# Altium schematic sheet micro8051.SchDoc
size B
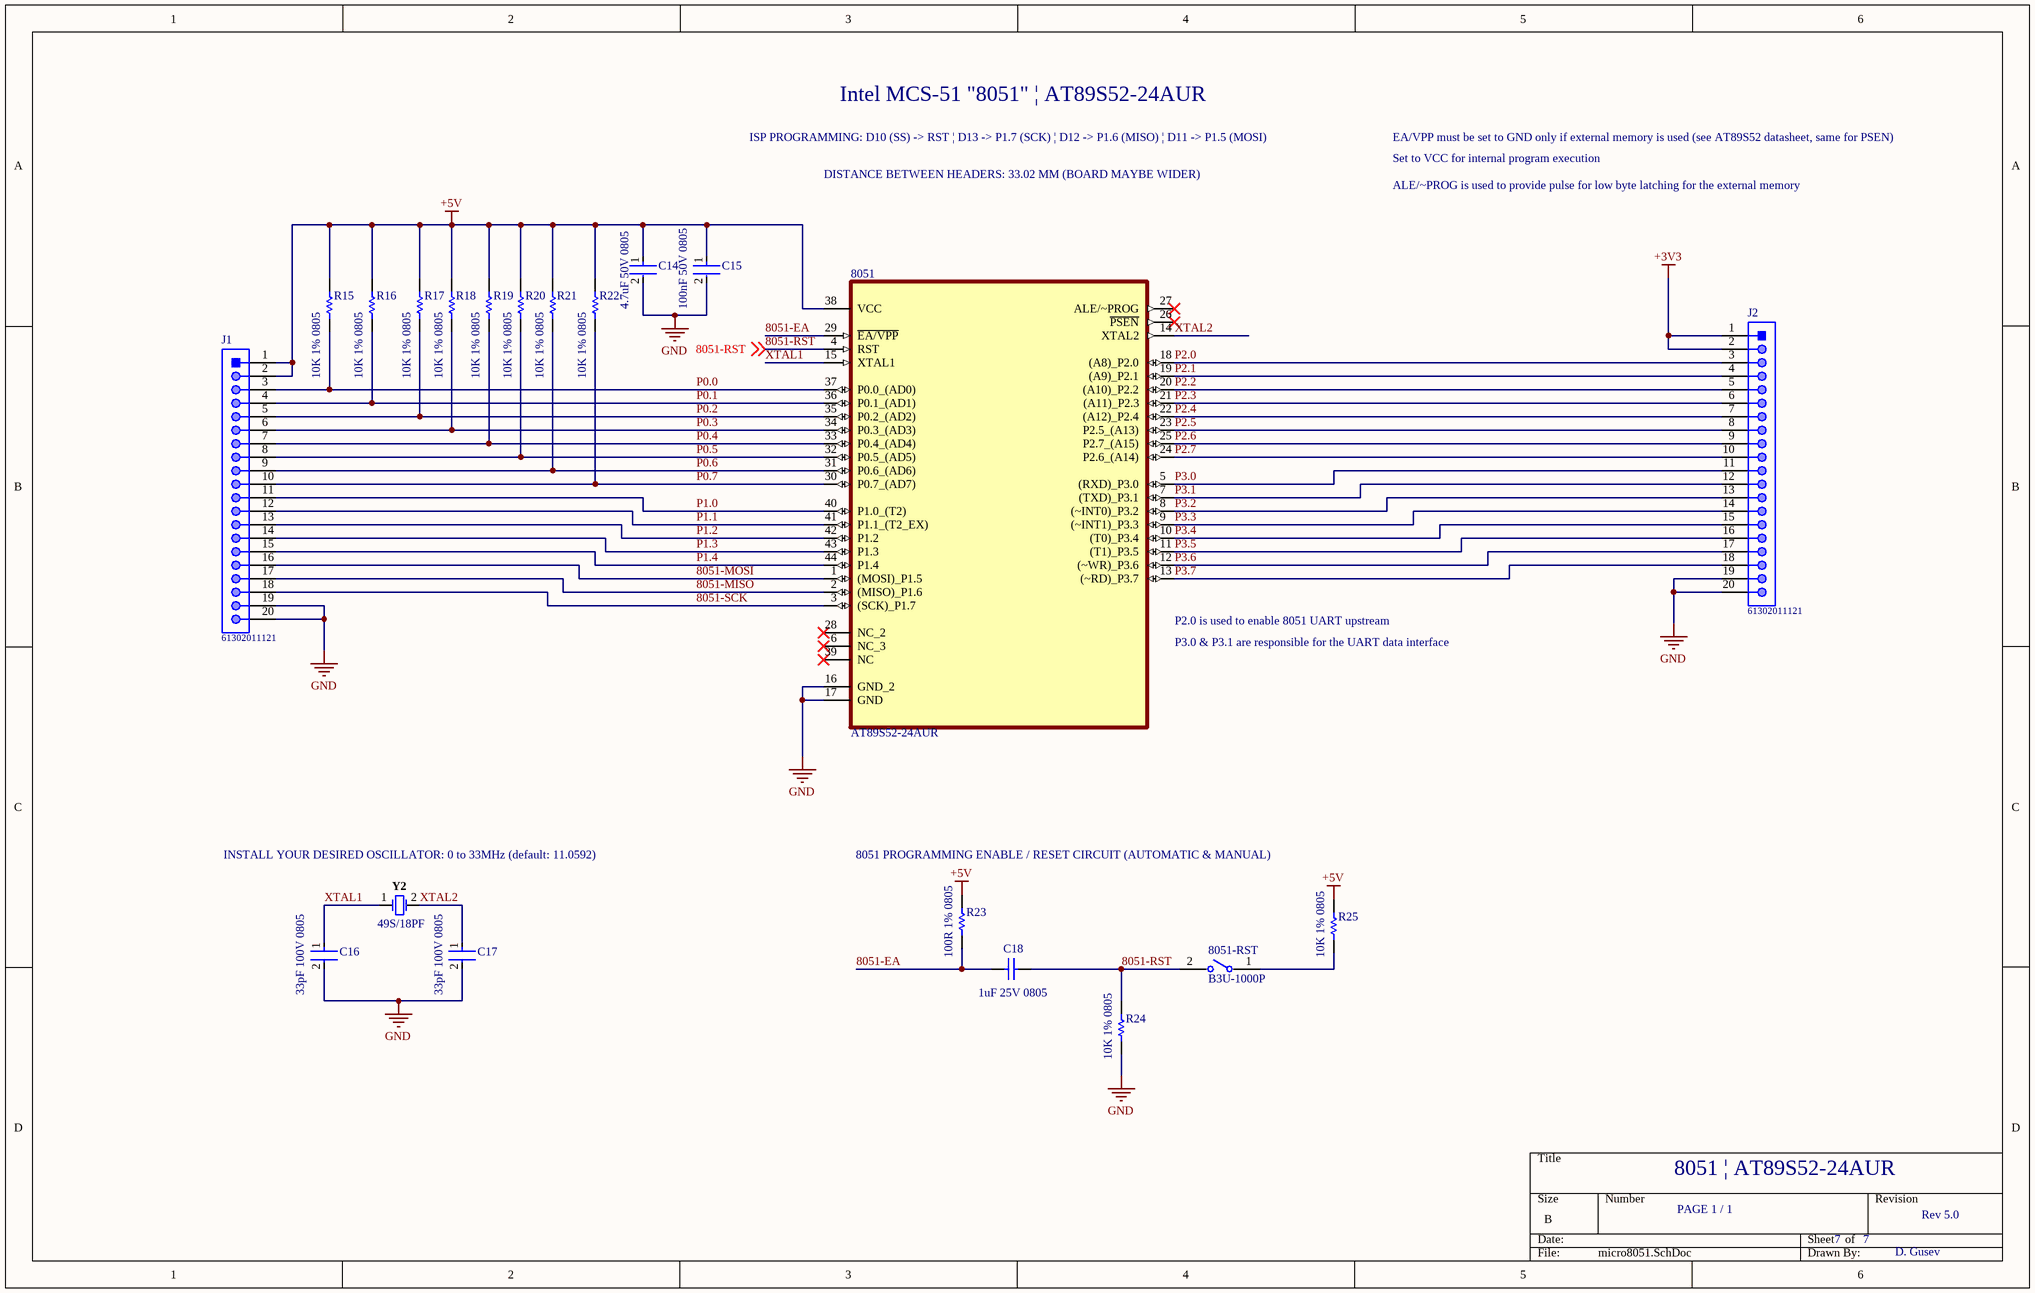
[diagram p0: micro8051.SchDoc]

## Parts
8051  AT89S52-24AUR  [AT89S52-24AUR]
8051-RST  B3U-1000P  [FP-B3U-1000P-MFG]
C14  4.7uF 50V 0805  [FP-C2012-125-MFG]
C15  100nF 50V 0805  [FP-C0805C-DN-MFG]
C16  33pF 100V 0805  [FP-C0805C-DN-MFG]
C17  33pF 100V 0805  [FP-C0805C-DN-MFG]
C18  1uF 25V 0805  [CAPC2013X140X50LL20T25]
J1  61302011121  [61302011121]
J2  61302011121  [61302011121]
R15  10K 1% 0805  [RESC2013X60X35NL10T20]
R16  10K 1% 0805  [RESC2013X60X35NL10T20]
R17  10K 1% 0805  [RESC2013X60X35NL10T20]
R18  10K 1% 0805  [RESC2013X60X35NL10T20]
R19  10K 1% 0805  [RESC2013X60X35NL10T20]
R20  10K 1% 0805  [RESC2013X60X35NL10T20]
R21  10K 1% 0805  [RESC2013X60X35NL10T20]
R22  10K 1% 0805  [RESC2013X60X35NL10T20]
R23  100R 1% 0805  [RESC2013X60X35ML10T20]
R24  10K 1% 0805  [RESC2013X60X35NL10T20]
R25  10K 1% 0805  [RESC2013X60X35NL10T20]
Y2  49S/18PF  [JPY-49S-18PF]

## Nets
+3V3: J2.1 J2.2
+5V: 8051.38(VCC) C14.1 C15.1 J1.1 J1.2 R15.2 R16.2 R17.2 R18.2 R19.2 R20.2 R21.2 R22.2 R23.2 R25.2
GND: 8051.16(GND_2) 8051.17(GND) C14.2 C15.2 C16.2 C17.2 J1.19 J1.20 J2.19 J2.20 R24.1
8051-EA: 8051.29(~{EA/VPP}) C18.1 R23.1
8051-MISO: 8051.2((MISO)_P1.6) J1.17
8051-MOSI: 8051.1((MOSI)_P1.5) J1.16
8051-RST: 8051.4(RST) 8051-RST.2 C18.2 R24.2 ; off-sheet 8051-RST
8051-SCK: 8051.3((SCK)_P1.7) J1.18
P0.0: 8051.37(P0.0_(AD0)) J1.3 R15.1
P0.1: 8051.36(P0.1_(AD1)) J1.4 R16.1
P0.2: 8051.35(P0.2_(AD2)) J1.5 R17.1
P0.3: 8051.34(P0.3_(AD3)) J1.6 R18.1
P0.4: 8051.33(P0.4_(AD4)) J1.7 R19.1
P0.5: 8051.32(P0.5_(AD5)) J1.8 R20.1
P0.6: 8051.31(P0.6_(AD6)) J1.9 R21.1
P0.7: 8051.30(P0.7_(AD7)) J1.10 R22.1
P1.0: 8051.40(P1.0_(T2)) J1.11
P1.1: 8051.41(P1.1_(T2_EX)) J1.12
P1.2: 8051.42(P1.2) J1.13
P1.3: 8051.43(P1.3) J1.14
P1.4: 8051.44(P1.4) J1.15
P2.0: 8051.18((A8)_P2.0) J2.3
P2.1: 8051.19((A9)_P2.1) J2.4
P2.2: 8051.20((A10)_P2.2) J2.5
P2.3: 8051.21((A11)_P2.3) J2.6
P2.4: 8051.22((A12)_P2.4) J2.7
P2.5: 8051.23(P2.5_(A13)) J2.8
P2.6: 8051.25(P2.7_(A15)) J2.9
P2.7: 8051.24(P2.6_(A14)) J2.10
P3.0: 8051.5((RXD)_P3.0) J2.11
P3.1: 8051.7((TXD)_P3.1) J2.12
P3.2: 8051.8((~INT0)_P3.2) J2.13
P3.3: 8051.9((~INT1)_P3.3) J2.14
P3.4: 8051.10((T0)_P3.4) J2.15
P3.5: 8051.11((T1)_P3.5) J2.16
P3.6: 8051.12((~WR)_P3.6) J2.17
P3.7: 8051.13((~RD)_P3.7) J2.18
XTAL1: 8051.15(XTAL1) C16.1 Y2.1
XTAL2: 8051.14(XTAL2) C17.1 Y2.2
Net8051-RST_1: 8051-RST.1 R25.1

Not connected (* = marked no-connect by the designer): 8051 6(NC_3)* 26(~{PSEN})* 27(ALE/~PROG)* 28(NC_2)* 39(NC)*

## Notes on the sheet
- ISP PROGRAMMING: D10 (SS) -> RST | D13 -> P1.7 (SCK) | D12 -> P1.6 (MISO) | D11 -> P1.5 (MOSI)
- Intel MCS-51 "8051" | AT89S52-24AUR
- EA/VPP must be set to GND only if external memory is used (see AT89S52 datasheet, same for PSEN)
- Set to VCC for internal program execution
- DISTANCE BETWEEN HEADERS: 33.02 MM (BOARD MAYBE WIDER)
- ALE/~PROG is used to provide pulse for low byte latching for the external memory
- (near 8051) P2.0 is used to enable 8051 UART upstream
- (near 8051) P3.0 & P3.1 are responsible for the UART data interface
- (near Y2) INSTALL YOUR DESIRED OSCILLATOR: 0 to 33MHz (default: 11.0592)
- (near R23) 8051 PROGRAMMING ENABLE / RESET CIRCUIT (AUTOMATIC & MANUAL)
- 8051 | AT89S52-24AUR
- PAGE 1 / 1
- 7
- Rev 5.0
- D. Gusev

## Library data of the parts
8051-RST = CMP-2100-03586-2: SWITCH TACTILE SPST-NO 0.05A 12V; Contact Resistance: 100mR; Operating Force: 1.5N; Max Current Rating: 50mA; Switch Travel: 0.15mm; Actuator Type: Standard; Mechanical Life: 200000Cycles; Ratings: Dust Proof; Illumination Type: Non-Illuminated; Throw Configuration: SPST; Actuator Length: 0.4mm; Switch Function: Off-Mom; Height: 1.2mm; Width: 3mm; Weight: 0.000776oz; Contact Material: Silver; Max Voltage Rating (DC): 12V; Insulation Resistance: 100MR; Lead Free: Lead Free; Current Rating: 50mA; Termination: SMD/SMT; Length: 4mm; Voltage Rating (DC): 12V; Contact Current Rating: 50mA; Orientation: Straight; Depth: 2.5mm; Max Operating Temperature: 70°C; Packaging: Tape and Reel; Min Operating Temperature: -25°C; Package Quantity: 1; Mount: Surface Mount; Electrical Life: 200000Cycles
C14 = CMP-08246-000007-1: CAP CER 4.7UF 50V X5R 0805; Manufacturer Part Number: C2012X5R1H475K125AB; Manufacturer: TDK Corporation; Tolerance: 10%; Temperature Coefficient: 15%; Material: Ceramic; Mouser Description: Multilayer Ceramic Capacitors MLCC - SMD/SMT 0805 4.7uF 50volts X5R 10%; Category: Cap; Temperature Range High: +85°C; Digikey Description: CAP CER 4.7UF 50V X5R 0805; Voltage Rating: 50V; Device Class L1: Passive Components; Temperature Range Low: -55°C; Lead Free: Yes; ComponentLink2Description: Datasheet; Capacitance: 4.7uF; Octopart: https://octopart.com/c2012x5r1h475k125ab-tdk-25947720; Device Class L2: Capacitors; Value: 4.7uF; Temperature: -55°C to +85°C; ComponentLink2URL: https://product.tdk.com/info/en/catalog/datasheets/mlcc_commercial_general_en.pdf; RoHS: TRUE; Height: 1.45mm; Temperature Characteristic: X5R; Package: C2012-125; Device Class L3: Ceramic Capacitors; Automotive: No
C15 = CMP-2007-00279-2: CAP CER 0.1UF 50V X7R 0805; Manufacturer Part Number: C0805C104K5RACTU; Manufacturer: KEMET; Value: 0.10 μF; Tolerance: 0.1; Temperature Coefficient: 30ppm/°C; Material: Ceramic; Device Class L2: Capacitors; Temperature Range Low: -55°C; Voltage Rating: 50 V; Digikey Description: CAP CER 0.1UF 50V X7R 0805; Category: Cap; ComponentLink2Description: Datasheet; Octopart: https://octopart.com/c0805c104k5ractu-kemet-143926; RoHS: TRUE; ComponentLink2URL: https://content.kemet.com/datasheets/KEM_C1003_C0G_SMD.pdf; Temperature Characteristic: X7R; Temperature: -55°C to +125°C; Height: 0.88mm; Temperature Range High: +125°C; Device Class L1: Passive Components; Automotive: No; Lead Free: Yes; Ipc Land Pattern Name: CAPC200125X78; Device Class L3: Ceramic Capacitors; Mouser Description: Cap Ceramic 0.1uF 50V X7R 10% SMD 2.0 x 1.2 mm 125 C Paper T/R; Capacitance: 0.10 μF; Package: C0805C-DN
C16 C17 = CMP-1036-01444-3: CAP CER 33PF 100V 5% NP0 0805; Manufacturer: KEMET; Manufacturer Part Number: C0805C330J1GACTU; Material: Ceramic; Temperature Characteristic: C0G; Temperature Coefficient: 30ppm/°C; Tolerance: 0.05; ComponentLink2URL: https://content.kemet.com/datasheets/KEM_C1003_C0G_SMD.pdf; Package: C0805C-DN; Temperature Range Low: -55°C; Height: 0.88mm; Digikey Description: CAP CER 33PF 100V 5% NP0 0805; Temperature: -55°C to +125°C; Capacitance: 33 pF; Temperature Range High: +125°C; RoHS: TRUE; Automotive: No; Octopart: https://octopart.com/c0805c330j1gactu-kemet-2226180; Mouser Description: Cap Ceramic 33pF 100V C0G 5% SMD 0805 125°C Plastic T/R; Device Class L2: Capacitors; ComponentLink2Description: Datasheet; Voltage Rating: 100 V; Lead Free: Yes; Device Class L1: Passive Components; Device Class L3: Ceramic Capacitors; Ipc Land Pattern Name: CAPC200125X78; Category: Cap; Value: 33 pF
C18 = CMP-2007-03234-1: Part Number: C0805C105K3RACTU; Manufacturer: Kemet
J1 J2 = CMP-1502-01102-1: THT Vertical Pin Header WR-PHD, Pitch 2.54 mm, Single Row, 20 pins; Manufacturer: Wurth Elektronik; Withstanding Voltage: 500VAC; Gender: Male; Pin Number: 20; Rated Current: 3A; Contact Resistance: 20mOhm; Pitch: 2.54mm; Working Voltage: 250VAC; Publisher: WurthElektronik; Packaging: Bag; Datasheet URL: https://katalog.we-online.de/em/datasheet/6130xx11121.pdf; Row Number: Single; Mounting Technology: THT; Manufacturer URL: http://www.we-online.de; Orientation: Vertical; Package Reference: 61302011121; Part Number: 61302011121; Operating Temperature: -40to105degC
R15-R22 R24 R25 = CMP-1659-00013-4: Chip Resistor, 10 KOhm, +/- 1%, 0.125 W, -55 to 155 degC, 0805 (2012 Metric), RoHS, Tape and Reel; Manufacturer: Yageo; Voltage Rating: 150 V; Mount: Surface Mount; ComponentLink1Description: Manufacturer URL; ComponentLink2URL: http://www.yageo.com/documents/recent/PYu-RC_Group_51_RoHS_L_04.pdf; Pins: 2; Length: 2 mm; Min Operating Temperature: -55 degC; Height: 0.5 mm; Mounting Technology: Surface Mount; RoHSCompliant: true; REACH SVHC: No SVHC; ComponentLink1URL: http://www.yageo.com/; Max Operating Temperature: 155 degC; PackageReference: 0805; DatasheetVersion: Rev. 4, 02/2016; Package Quantity: 5000; Packaging: Tape and Reel; ComponentLink2Description: Datasheet; PackageDescription: 2-Pin Surface Mounted Device, Body 2 x 1.25 mm
R23 = CMP-2100-03669-1: Chip Resistor, 100 Ohm, +/-1%, 0.125 W, -55 to 155 degC, 0805 (2012 Metric), RoHS, Tape and Reel; Manufacturer: Yageo; Power Rating: 125mW; Resistance: 100Ohm; Voltage Rating: 150V; Temperature Coefficient: 100ppm/degreesC; Length: 2mm; Package Description: 2-Pin Surface Mounted Device, Body 2 x 1.25 mm; Case Code (Imperial): 0805; Number of Pins: 2; Termination: SMD/SMT; Lead Pitch: 0.4mm; Package Quantity: 1; Height: 0.024inch; Case Code (Metric): 2012; Number of Terminations: 2; Datasheet Version: Rev. 5, 10/2016; Lead Free: LeadFree; Package Reference: 0805; Composition: ThickFilm; REACH SVHC: Unknown; Voltage Rating (DC): 150V; Min Operating Temperature: -55degC; Packaging: TapeandReel; Military Standard: Not; Tolerance: 1%; Case/Package: 0805; Datasheet URL: http://www.yageo.com/NewPortal/yageodocoutput?fileName=/pdf/R-Chip/PYu-RC_Group_51_RoHS_L_5.pdf; Max Operating Temperature: 155degC; Manufacturer URL: http://www.yageo.com/; Max Power Dissipation: 125mW; Width: 0.049inch; Depth: 1.25mm; RoHSCompliant: true
Y2 = CMP-2100-03581-1: Crystal, 16 MHz, 18 pF, -20 to 70 degC, 2-Pin THD; Manufacturer: Shenzhen Jingpengyuan; Package Description: 2-Pin Through Hole Device, Body 11.05 x 4.65 mm, Pitch 4.88 mm; Package Reference: 49S-18PF; Datasheet Version: 41852.0; Datasheet URL: http://datasheet.octopart.com/49S-18PF-Xinhunjing-datasheet-30677139.pdf; Manufacturer URL: http://www.chjiahui.com/